# EAGLE schematic light_120mm_v1_0 (EAGLE 9.6.1)
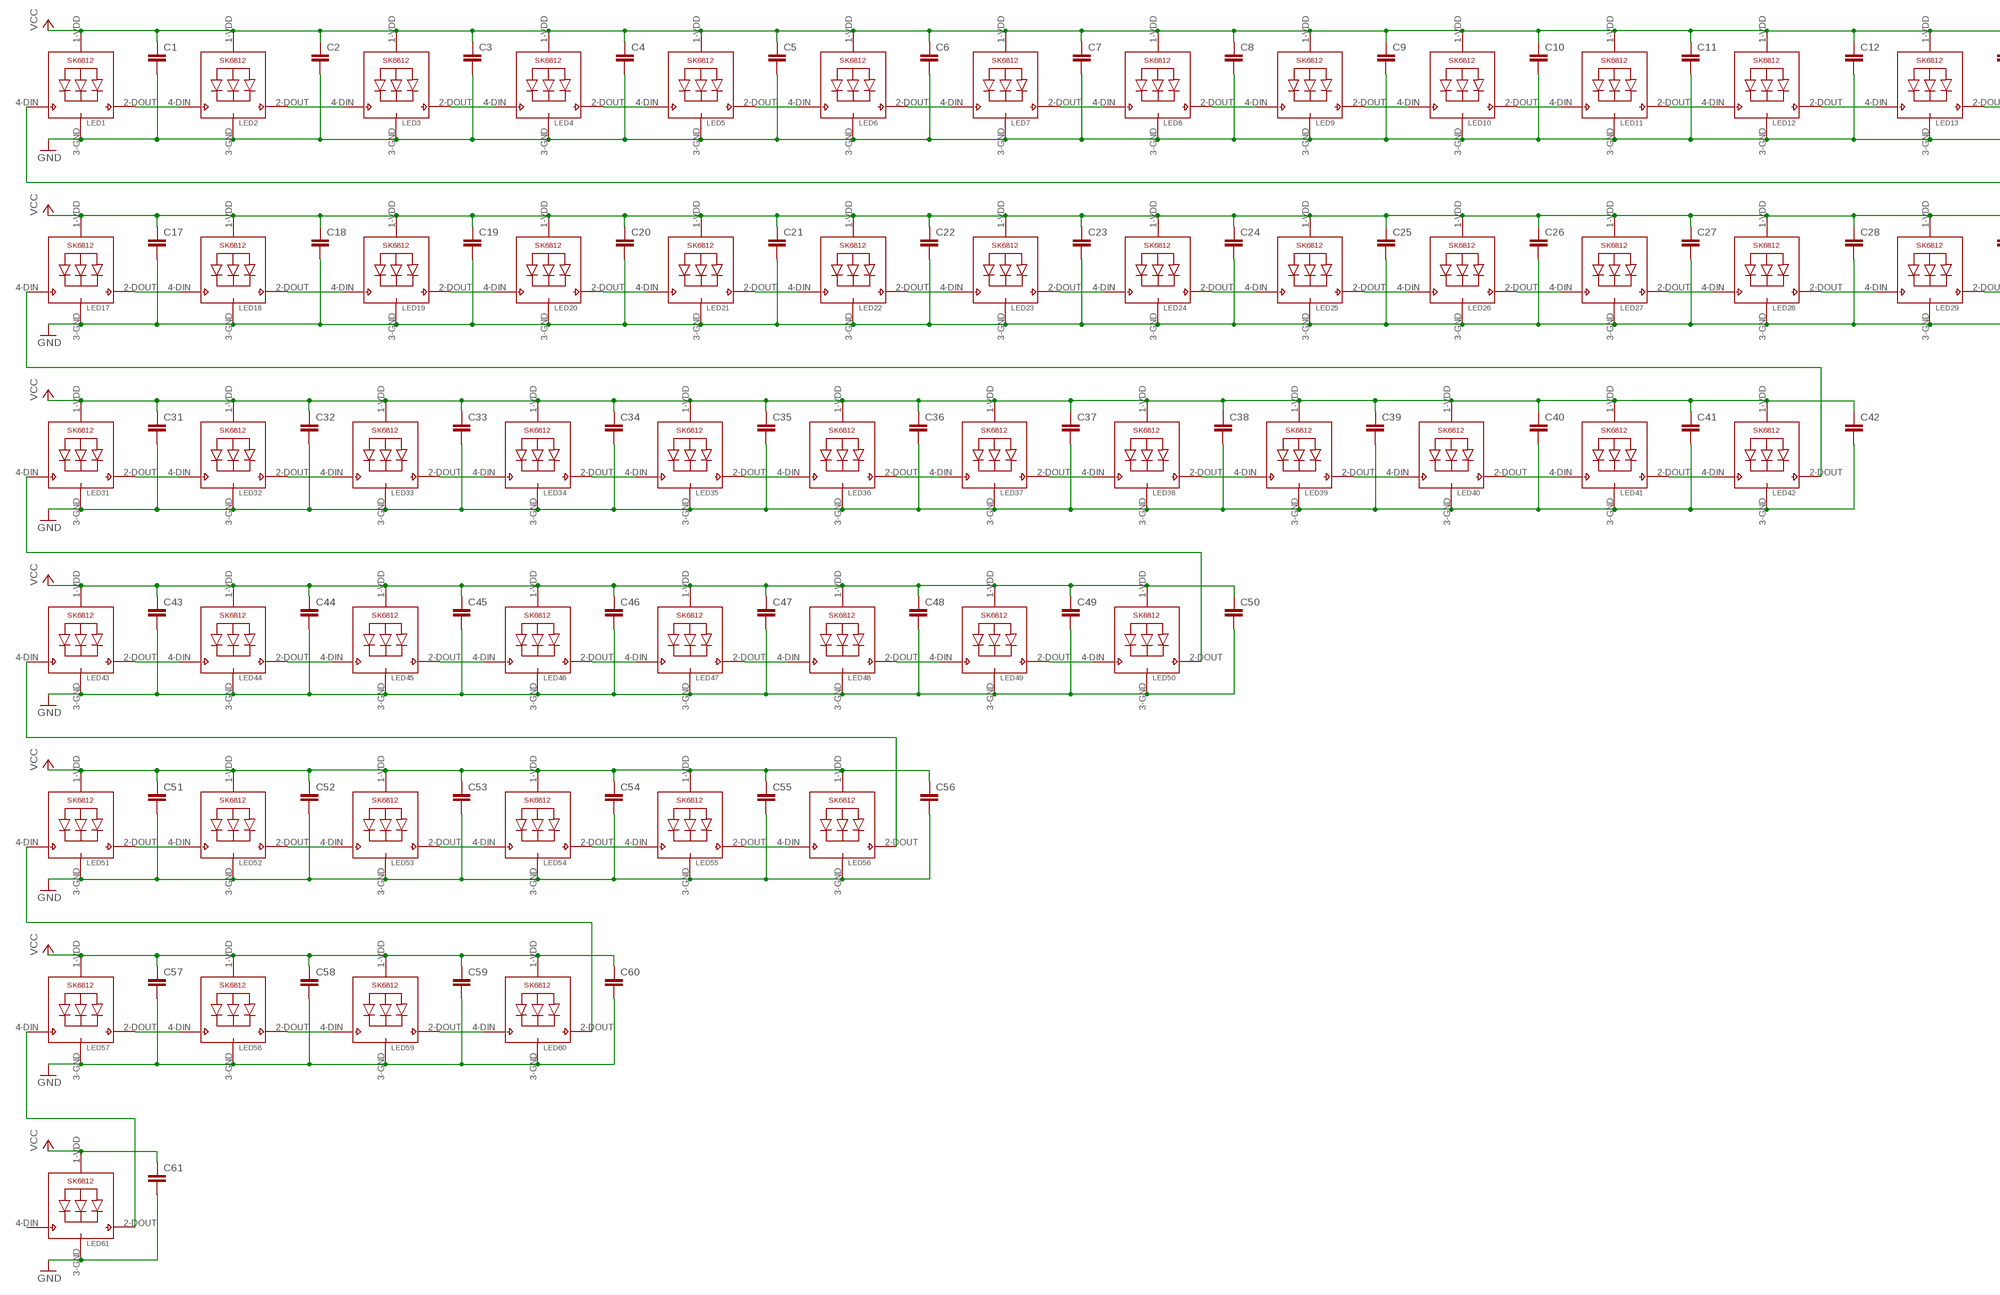
[diagram p0: schematic, sheet 1, part 1 of 2]
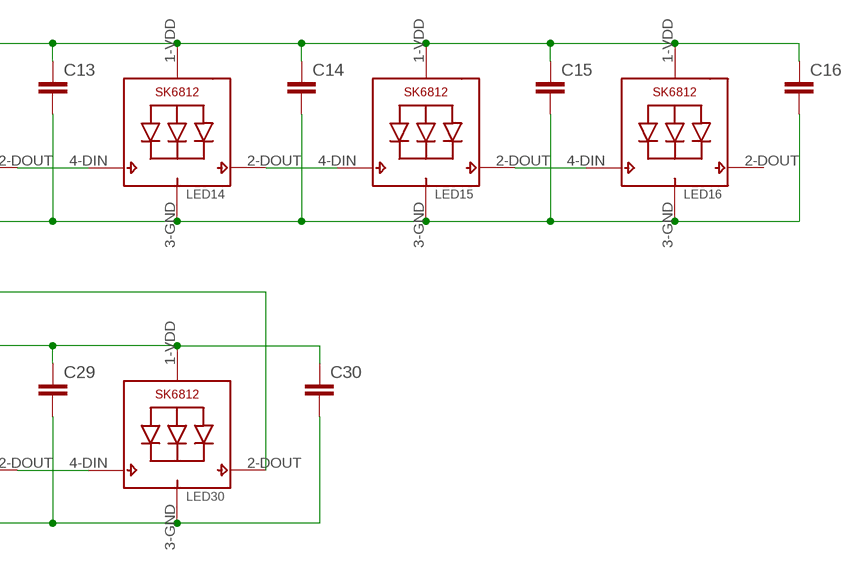
[diagram p1: schematic, sheet 1, part 2 of 2]

## Parts
C1  C-EUC0805  [C0805]
C2  C-EUC0805  [C0805]
C3  C-EUC0805  [C0805]
C4  C-EUC0805  [C0805]
C5  C-EUC0805  [C0805]
C6  C-EUC0805  [C0805]
C7  C-EUC0805  [C0805]
C8  C-EUC0805  [C0805]
C9  C-EUC0805  [C0805]
C10  C-EUC0805  [C0805]
C11  C-EUC0805  [C0805]
C12  C-EUC0805  [C0805]
C13  C-EUC0805  [C0805]
C14  C-EUC0805  [C0805]
C15  C-EUC0805  [C0805]
C16  C-EUC0805  [C0805]
C17  C-EUC0805  [C0805]
C18  C-EUC0805  [C0805]
C19  C-EUC0805  [C0805]
C20  C-EUC0805  [C0805]
C21  C-EUC0805  [C0805]
C22  C-EUC0805  [C0805]
C23  C-EUC0805  [C0805]
C24  C-EUC0805  [C0805]
C25  C-EUC0805  [C0805]
C26  C-EUC0805  [C0805]
C27  C-EUC0805  [C0805]
C28  C-EUC0805  [C0805]
C29  C-EUC0805  [C0805]
C30  C-EUC0805  [C0805]
C31  C-EUC0805  [C0805]
C32  C-EUC0805  [C0805]
C33  C-EUC0805  [C0805]
C34  C-EUC0805  [C0805]
C35  C-EUC0805  [C0805]
C36  C-EUC0805  [C0805]
C37  C-EUC0805  [C0805]
C38  C-EUC0805  [C0805]
C39  C-EUC0805  [C0805]
C40  C-EUC0805  [C0805]
C41  C-EUC0805  [C0805]
C42  C-EUC0805  [C0805]
C43  C-EUC0805  [C0805]
C44  C-EUC0805  [C0805]
C45  C-EUC0805  [C0805]
C46  C-EUC0805  [C0805]
C47  C-EUC0805  [C0805]
C48  C-EUC0805  [C0805]
C49  C-EUC0805  [C0805]
C50  C-EUC0805  [C0805]
C51  C-EUC0805  [C0805]
C52  C-EUC0805  [C0805]
C53  C-EUC0805  [C0805]
C54  C-EUC0805  [C0805]
C55  C-EUC0805  [C0805]
C56  C-EUC0805  [C0805]
C57  C-EUC0805  [C0805]
C58  C-EUC0805  [C0805]
C59  C-EUC0805  [C0805]
C60  C-EUC0805  [C0805]
C61  C-EUC0805  [C0805]
LED1  SK6812_5050W  [LED5050_W]
LED2  SK6812_5050W  [LED5050_W]
LED3  SK6812_5050W  [LED5050_W]
LED4  SK6812_5050W  [LED5050_W]
LED5  SK6812_5050W  [LED5050_W]
LED6  SK6812_5050W  [LED5050_W]
LED7  SK6812_5050W  [LED5050_W]
LED8  SK6812_5050W  [LED5050_W]
LED9  SK6812_5050W  [LED5050_W]
LED10  SK6812_5050W  [LED5050_W]
LED11  SK6812_5050W  [LED5050_W]
LED12  SK6812_5050W  [LED5050_W]
LED13  SK6812_5050W  [LED5050_W]
LED14  SK6812_5050W  [LED5050_W]
LED15  SK6812_5050W  [LED5050_W]
LED16  SK6812_5050W  [LED5050_W]
LED17  SK6812_5050W  [LED5050_W]
LED18  SK6812_5050W  [LED5050_W]
LED19  SK6812_5050W  [LED5050_W]
LED20  SK6812_5050W  [LED5050_W]
LED21  SK6812_5050W  [LED5050_W]
LED22  SK6812_5050W  [LED5050_W]
LED23  SK6812_5050W  [LED5050_W]
LED24  SK6812_5050W  [LED5050_W]
LED25  SK6812_5050W  [LED5050_W]
LED26  SK6812_5050W  [LED5050_W]
LED27  SK6812_5050W  [LED5050_W]
LED28  SK6812_5050W  [LED5050_W]
LED29  SK6812_5050W  [LED5050_W]
LED30  SK6812_5050W  [LED5050_W]
LED31  SK6812_5050W  [LED5050_W]
LED32  SK6812_5050W  [LED5050_W]
LED33  SK6812_5050W  [LED5050_W]
LED34  SK6812_5050W  [LED5050_W]
LED35  SK6812_5050W  [LED5050_W]
LED36  SK6812_5050W  [LED5050_W]
LED37  SK6812_5050W  [LED5050_W]
LED38  SK6812_5050W  [LED5050_W]
LED39  SK6812_5050W  [LED5050_W]
LED40  SK6812_5050W  [LED5050_W]
LED41  SK6812_5050W  [LED5050_W]
LED42  SK6812_5050W  [LED5050_W]
LED43  SK6812_5050W  [LED5050_W]
LED44  SK6812_5050W  [LED5050_W]
LED45  SK6812_5050W  [LED5050_W]
LED46  SK6812_5050W  [LED5050_W]
LED47  SK6812_5050W  [LED5050_W]
LED48  SK6812_5050W  [LED5050_W]
LED49  SK6812_5050W  [LED5050_W]
LED50  SK6812_5050W  [LED5050_W]
LED51  SK6812_5050W  [LED5050_W]
LED52  SK6812_5050W  [LED5050_W]
LED53  SK6812_5050W  [LED5050_W]
LED54  SK6812_5050W  [LED5050_W]
LED55  SK6812_5050W  [LED5050_W]
LED56  SK6812_5050W  [LED5050_W]
LED57  SK6812_5050W  [LED5050_W]
LED58  SK6812_5050W  [LED5050_W]
LED59  SK6812_5050W  [LED5050_W]
LED60  SK6812_5050W  [LED5050_W]
LED61  SK6812_5050W  [LED5050_W]

## Nets
GND: C1.2 C2.2 C3.2 C4.2 C5.2 C6.2 C7.2 C8.2 C9.2 C10.2 C11.2 C12.2 C13.2 C14.2 C15.2 C16.2 C17.2 C18.2 C19.2 C20.2 C21.2 C22.2 C23.2 C24.2 C25.2 C26.2 C27.2 C28.2 C29.2 C30.2 C31.2 C32.2 C33.2 C34.2 C35.2 C36.2 C37.2 C38.2 C39.2 C40.2 C41.2 C42.2 C43.2 C44.2 C45.2 C46.2 C47.2 C48.2 C49.2 C50.2 C51.2 C52.2 C53.2 C54.2 C55.2 C56.2 C57.2 C58.2 C59.2 C60.2 C61.2 LED1.3-GND(GND) LED2.3-GND(GND) LED3.3-GND(GND) LED4.3-GND(GND) LED5.3-GND(GND) LED6.3-GND(GND) LED7.3-GND(GND) LED8.3-GND(GND) LED9.3-GND(GND) LED10.3-GND(GND) LED11.3-GND(GND) LED12.3-GND(GND) LED13.3-GND(GND) LED14.3-GND(GND) LED15.3-GND(GND) LED16.3-GND(GND) LED17.3-GND(GND) LED18.3-GND(GND) LED19.3-GND(GND) LED20.3-GND(GND) LED21.3-GND(GND) LED22.3-GND(GND) LED23.3-GND(GND) LED24.3-GND(GND) LED25.3-GND(GND) LED26.3-GND(GND) LED27.3-GND(GND) LED28.3-GND(GND) LED29.3-GND(GND) LED30.3-GND(GND) LED31.3-GND(GND) LED32.3-GND(GND) LED33.3-GND(GND) LED34.3-GND(GND) LED35.3-GND(GND) LED36.3-GND(GND) LED37.3-GND(GND) LED38.3-GND(GND) LED39.3-GND(GND) LED40.3-GND(GND) LED41.3-GND(GND) LED42.3-GND(GND) LED43.3-GND(GND) LED44.3-GND(GND) LED45.3-GND(GND) LED46.3-GND(GND) LED47.3-GND(GND) LED48.3-GND(GND) LED49.3-GND(GND) LED50.3-GND(GND) LED51.3-GND(GND) LED52.3-GND(GND) LED53.3-GND(GND) LED54.3-GND(GND) LED55.3-GND(GND) LED56.3-GND(GND) LED57.3-GND(GND) LED58.3-GND(GND) LED59.3-GND(GND) LED60.3-GND(GND) LED61.3-GND(GND)
N$1: LED1.2-DOUT(DO) LED2.4-DIN(DI)
N$2: LED2.2-DOUT(DO) LED3.4-DIN(DI)
N$3: LED3.2-DOUT(DO) LED4.4-DIN(DI)
N$4: LED4.2-DOUT(DO) LED5.4-DIN(DI)
N$5: LED5.2-DOUT(DO) LED6.4-DIN(DI)
N$6: LED6.2-DOUT(DO) LED7.4-DIN(DI)
N$7: LED7.2-DOUT(DO) LED8.4-DIN(DI)
N$8: LED8.2-DOUT(DO) LED9.4-DIN(DI)
N$9: LED9.2-DOUT(DO) LED10.4-DIN(DI)
N$10: LED10.2-DOUT(DO) LED11.4-DIN(DI)
N$11: LED11.2-DOUT(DO) LED12.4-DIN(DI)
N$12: LED12.2-DOUT(DO) LED13.4-DIN(DI)
N$13: LED13.2-DOUT(DO) LED14.4-DIN(DI)
N$14: LED14.2-DOUT(DO) LED15.4-DIN(DI)
N$23: LED15.2-DOUT(DO) LED16.4-DIN(DI)
N$24: LED43.4-DIN(DI) LED56.2-DOUT(DO)
N$25: LED17.2-DOUT(DO) LED18.4-DIN(DI)
N$26: LED18.2-DOUT(DO) LED19.4-DIN(DI)
N$27: LED19.2-DOUT(DO) LED20.4-DIN(DI)
N$28: LED20.2-DOUT(DO) LED21.4-DIN(DI)
N$29: LED21.2-DOUT(DO) LED22.4-DIN(DI)
N$30: LED22.2-DOUT(DO) LED23.4-DIN(DI)
N$31: LED23.2-DOUT(DO) LED24.4-DIN(DI)
N$32: LED24.2-DOUT(DO) LED25.4-DIN(DI)
N$33: LED25.2-DOUT(DO) LED26.4-DIN(DI)
N$34: LED26.2-DOUT(DO) LED27.4-DIN(DI)
N$35: LED27.2-DOUT(DO) LED28.4-DIN(DI)
N$36: LED28.2-DOUT(DO) LED29.4-DIN(DI)
N$37: LED29.2-DOUT(DO) LED30.4-DIN(DI)
N$38: LED31.4-DIN(DI) LED50.2-DOUT(DO)
N$39: LED31.2-DOUT(DO) LED32.4-DIN(DI)
N$40: LED32.2-DOUT(DO) LED33.4-DIN(DI)
N$41: LED33.2-DOUT(DO) LED34.4-DIN(DI)
N$42: LED34.2-DOUT(DO) LED35.4-DIN(DI)
N$43: LED35.2-DOUT(DO) LED36.4-DIN(DI)
N$44: LED36.2-DOUT(DO) LED37.4-DIN(DI)
N$45: LED37.2-DOUT(DO) LED38.4-DIN(DI)
N$46: LED38.2-DOUT(DO) LED39.4-DIN(DI)
N$47: LED39.2-DOUT(DO) LED40.4-DIN(DI)
N$48: LED40.2-DOUT(DO) LED41.4-DIN(DI)
N$49: LED41.2-DOUT(DO) LED42.4-DIN(DI)
N$50: LED17.4-DIN(DI) LED42.2-DOUT(DO)
N$51: LED43.2-DOUT(DO) LED44.4-DIN(DI)
N$52: LED44.2-DOUT(DO) LED45.4-DIN(DI)
N$53: LED45.2-DOUT(DO) LED46.4-DIN(DI)
N$54: LED46.2-DOUT(DO) LED47.4-DIN(DI)
N$55: LED47.2-DOUT(DO) LED48.4-DIN(DI)
N$56: LED48.2-DOUT(DO) LED49.4-DIN(DI)
N$57: LED49.2-DOUT(DO) LED50.4-DIN(DI)
N$58: LED1.4-DIN(DI) LED30.2-DOUT(DO)
N$59: LED51.2-DOUT(DO) LED52.4-DIN(DI)
N$60: LED52.2-DOUT(DO) LED53.4-DIN(DI)
N$61: LED53.2-DOUT(DO) LED54.4-DIN(DI)
N$62: LED54.2-DOUT(DO) LED55.4-DIN(DI)
N$63: LED55.2-DOUT(DO) LED56.4-DIN(DI)
N$64: LED57.4-DIN(DI) LED61.2-DOUT(DO)
N$65: LED57.2-DOUT(DO) LED58.4-DIN(DI)
N$66: LED58.2-DOUT(DO) LED59.4-DIN(DI)
N$67: LED59.2-DOUT(DO) LED60.4-DIN(DI)
N$69: LED51.4-DIN(DI) LED60.2-DOUT(DO)
VCC: C1.1 C2.1 C3.1 C4.1 C5.1 C6.1 C7.1 C8.1 C9.1 C10.1 C11.1 C12.1 C13.1 C14.1 C15.1 C16.1 C17.1 C18.1 C19.1 C20.1 C21.1 C22.1 C23.1 C24.1 C25.1 C26.1 C27.1 C28.1 C29.1 C30.1 C31.1 C32.1 C33.1 C34.1 C35.1 C36.1 C37.1 C38.1 C39.1 C40.1 C41.1 C42.1 C43.1 C44.1 C45.1 C46.1 C47.1 C48.1 C49.1 C50.1 C51.1 C52.1 C53.1 C54.1 C55.1 C56.1 C57.1 C58.1 C59.1 C60.1 C61.1 LED1.1-VDD(VDD) LED2.1-VDD(VDD) LED3.1-VDD(VDD) LED4.1-VDD(VDD) LED5.1-VDD(VDD) LED6.1-VDD(VDD) LED7.1-VDD(VDD) LED8.1-VDD(VDD) LED9.1-VDD(VDD) LED10.1-VDD(VDD) LED11.1-VDD(VDD) LED12.1-VDD(VDD) LED13.1-VDD(VDD) LED14.1-VDD(VDD) LED15.1-VDD(VDD) LED16.1-VDD(VDD) LED17.1-VDD(VDD) LED18.1-VDD(VDD) LED19.1-VDD(VDD) LED20.1-VDD(VDD) LED21.1-VDD(VDD) LED22.1-VDD(VDD) LED23.1-VDD(VDD) LED24.1-VDD(VDD) LED25.1-VDD(VDD) LED26.1-VDD(VDD) LED27.1-VDD(VDD) LED28.1-VDD(VDD) LED29.1-VDD(VDD) LED30.1-VDD(VDD) LED31.1-VDD(VDD) LED32.1-VDD(VDD) LED33.1-VDD(VDD) LED34.1-VDD(VDD) LED35.1-VDD(VDD) LED36.1-VDD(VDD) LED37.1-VDD(VDD) LED38.1-VDD(VDD) LED39.1-VDD(VDD) LED40.1-VDD(VDD) LED41.1-VDD(VDD) LED42.1-VDD(VDD) LED43.1-VDD(VDD) LED44.1-VDD(VDD) LED45.1-VDD(VDD) LED46.1-VDD(VDD) LED47.1-VDD(VDD) LED48.1-VDD(VDD) LED49.1-VDD(VDD) LED50.1-VDD(VDD) LED51.1-VDD(VDD) LED52.1-VDD(VDD) LED53.1-VDD(VDD) LED54.1-VDD(VDD) LED55.1-VDD(VDD) LED56.1-VDD(VDD) LED57.1-VDD(VDD) LED58.1-VDD(VDD) LED59.1-VDD(VDD) LED60.1-VDD(VDD) LED61.1-VDD(VDD)
Unconnected: LED16.2-DOUT(DO) LED61.4-DIN(DI)

## Library data of the parts
C1-C61 = rcl:C-EU: CAPACITOR, European symbol; SPICEPREFIX: C
LED1-LED61 = SK6812:SK6812